# EAGLE design Open Playback Recorder Bottom (EAGLE 9.6.2)
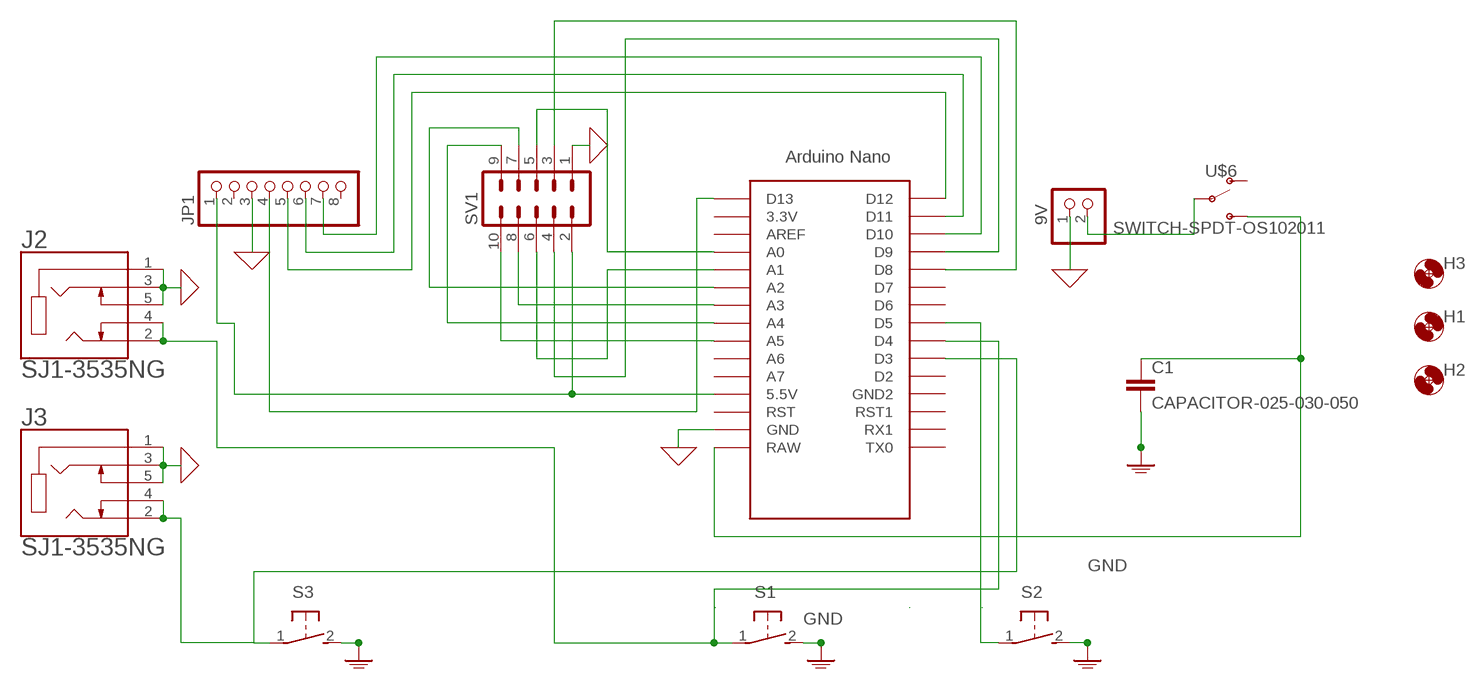
[diagram p0: schematic, sheet 1]

## Parts
9V  PINHD-1X2  [1X02]
C1  CAPACITOR-025-030-050  [CAP-025-030X050]
H1  MOUNT-HOLE-3MM-CLEAR  [HOLE-3MM-CLEAR]
H2  MOUNT-HOLE-3MM-CLEAR  [HOLE-3MM-CLEAR]
H3  MOUNT-HOLE-3MM-CLEAR  [HOLE-3MM-CLEAR]
J2  SJ1-3535NG  [CUI_SJ1-3535NG]
J3  SJ1-3535NG  [CUI_SJ1-3535NG]
JP1  HEADER_MALE-1X8ROUND  [1X08_ROUND]
S1  SWITCH_OMRON_RA-RA  [B3F-31XX]
S2  SWITCH_OMRON_RA-RA  [B3F-31XX]
S3  SWITCH_OMRON_RA-RA  [B3F-31XX]
SV1  MA05-2  [MA05-2]
U$1  NANO  [NANO]
U$6  SWITCH-SPDT-OS102011  [SWITCH_SPDT_11MA1QS1]

## Nets
GND: 9V.1 J2.1 J2.3 J2.5 J3.1 J3.3 J3.5 JP1.3 S1.2 S2.2 S3.2 SV1.1 U$1.GND
GND1: C1.2 ; supply symbol labelled GND
N$1: JP1.1 SV1.2 U$1.5V(5.5V)
N$6: 9V.2 U$6.2(P)
N$7: C1.1 U$1.RAW U$6.3(S)
N$15: J3.2 J3.4 S3.1 U$1.D3
N$19: J2.2 J2.4 S1.1 U$1.D4
N$20: S2.1 U$1.D5
N$22: SV1.10 U$1.A5
N$23: SV1.9 U$1.A4
N$24: SV1.8 U$1.A3
N$25: SV1.7 U$1.A2
N$26: SV1.6 U$1.A1
N$27: SV1.3 U$1.D8
N$28: SV1.4 U$1.D9
N$29: SV1.5 U$1.A0
N$30: JP1.7 U$1.D10
N$31: JP1.6 U$1.D11
N$32: JP1.5 U$1.D12
N$33: JP1.4 U$1.D13
Unconnected: JP1.2 JP1.8 U$1.3.3V U$1.A6 U$1.A7 U$1.AREF U$1.D2 U$1.D6 U$1.D7 U$1.GND1(GND2) U$1.ICSP1 U$1.ICSP2 U$1.ICSP3 U$1.ICSP4 U$1.ICSP5 U$1.ICSP6 U$1.RST U$1.RST1 U$1.RX1 U$1.TX0 U$6.1(O)

## Library data of the parts
9V = pinhead:PINHD-1X2: PIN HEADER
C1 = MMC_Eagle:CAPACITOR-
H1-H3 = MMC Eagle:MOUNT-HOLE-: MOUNTING HOLE with drill center marker
J2 J3 = SJ1-3535NG:SJ1-3535NG: SJ1 Series 3.5 mm 12 V Right Angle Through Hole Isolated Stereo Audio Jack; MANUFACTURER: CUI; PARTREV: 1.02; STANDARD: Manufacturer recommendation
JP1 = MMC_Eagle:HEADER_MALE-1X8: PIN HEADER
S1-S3 = MMC_Eagle:SWITCH_OMRON_RA: OMRON SWITCH Now with beefier pads!
SV1 = con-lstb:MA05-2: PIN HEADER; OC_FARNELL: unknown; OC_NEWARK: unknown
U$1 = Arduino-clone:NANO: Arduino Nano
U$6 = MMC_Eagle:SWITCH-SPDT-

## Board
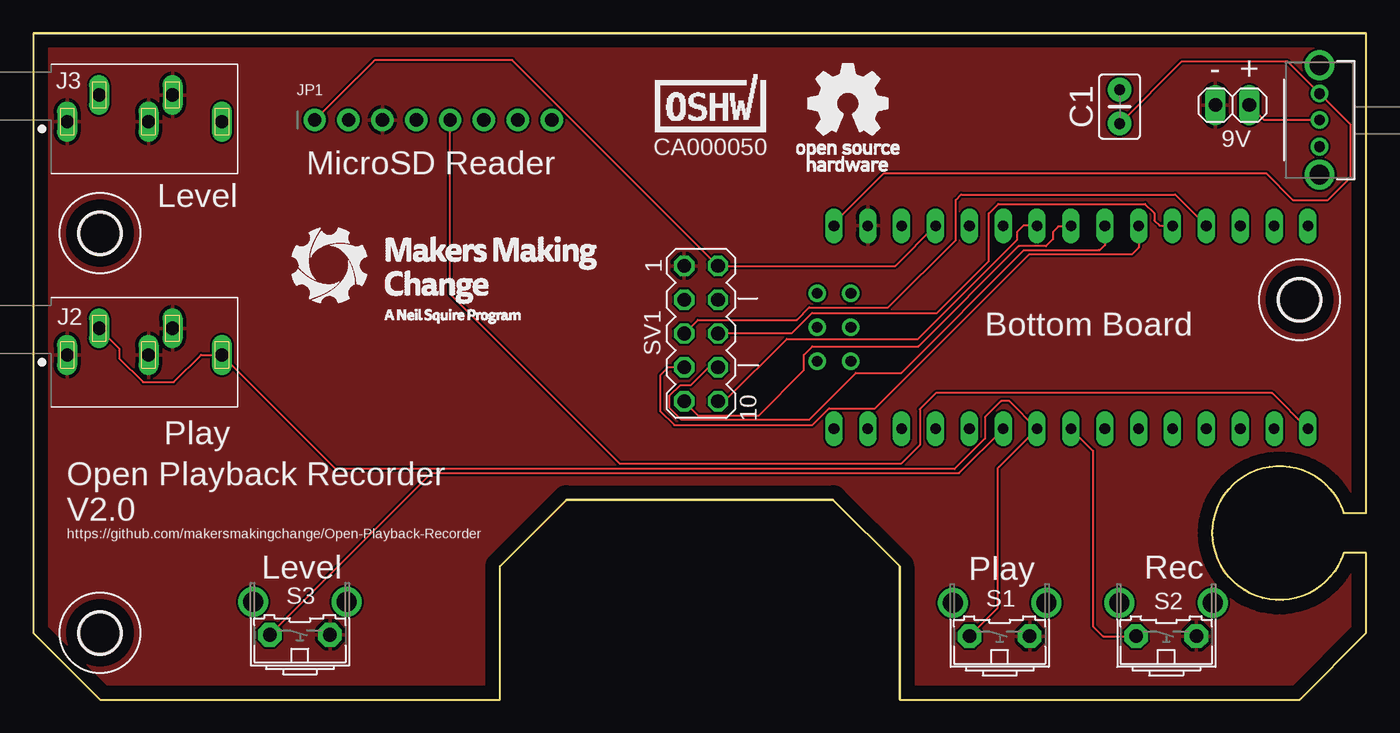
[diagram p1: board, top side]
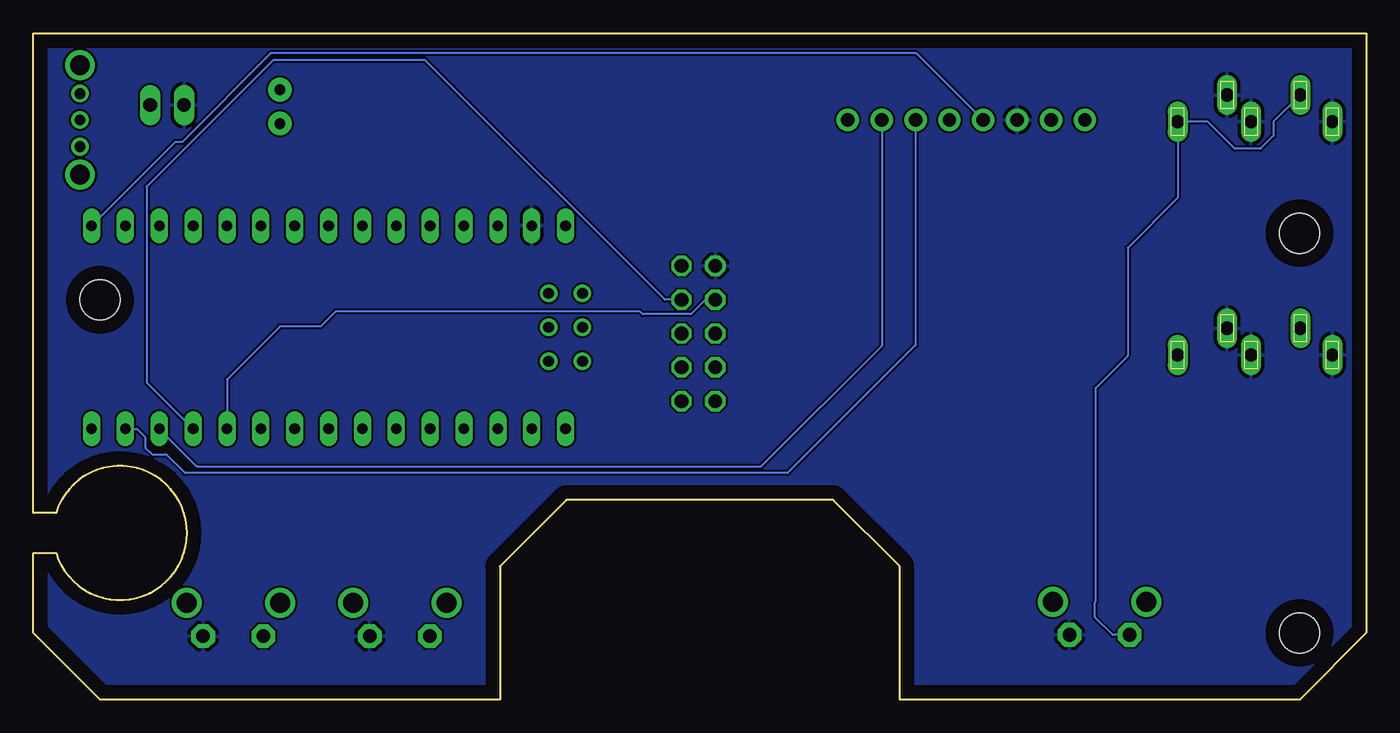
[diagram p2: board, bottom side, seen from below]

Size 100 x 50 mm. Coordinates in mm from the lower left corner, seen from the top.
Outline: 0,50 0,5 5,0 35,0 35,10 40,15 60,15 65,10 65,0 95,0 100,5 100,11 98.3,11 arc-325 98.3,14 100,14 100,50 0,50
Copper layers (1*16): Top 0.035mm / dielectric 1.5mm / Bottom 0.035mm
Design rules "default": minimum track width 6mil, minimum drill 0.35mm, track to track 6mil, track to pad 6mil, pad to pad 6mil, via to via 6mil, smd to smd 6mil, copper to edge 40mil, drill to drill 6mil, minimum pad ring 10mil, minimum via ring 8mil, stop-mask expansion 4mil, vias tented up to drill 0mil, thermal gap 10mil

### Footprints (pad centres in the part's own frame; a part is rotated, then mirrored left to right if it is on the bottom)
1X02 = drill 1.016 long: 1 -1.27,0; 2 1.27,0
CAP-025-030X050 = drill 0.813 pad 1.778: 1 -1.27,0; 2 1.27,0
HOLE-3MM-CLEAR = hole 3: 0,0
CUI_SJ1-3535NG = drill 1 long: 1 0,0; 2 2.4,2; 3 7.9,2; 4 11.6,0; 5 6.1,0
1X08_ROUND = drill 1 pad 1.676: 1 -8.89,0; 2 -6.35,0; 3 -3.81,0; 4 -1.27,0; 5 1.27,0; 6 3.81,0; 7 6.35,0; 8 8.89,0
B3F-31XX = drill 1.016 pad 1.778 octagon: 1 -2.261,-1.245; 2 2.261,-1.245 | drill 1.499 pad 2.032: 3 -3.505,1.245; 4 3.505,1.245
MA05-2 = drill 1.016 octagon: 1 -5.08,-1.27; 2 -5.08,1.27; 3 -2.54,-1.27; 4 -2.54,1.27; 5 0,-1.27; 6 0,1.27; 7 2.54,-1.27; 8 2.54,1.27; 9 5.08,-1.27; 10 5.08,1.27
NANO = drill 0.8 long: 3.3V -10.16,24.13; 5V -10.16,-1.27; A0 -10.16,19.05; A1 -10.16,16.51; A2 -10.16,13.97; A3 -10.16,11.43; A4 -10.16,8.89; A5 -10.16,6.35; A6 -10.16,3.81; A7 -10.16,1.27; AREF -10.16,21.59; D2 5.08,1.27; D3 5.08,3.81; D4 5.08,6.35; D5 5.08,8.89; D6 5.08,11.43; D7 5.08,13.97; D8 5.08,16.51; D9 5.08,19.05; D10 5.08,21.59; D11 5.08,24.13; D12 5.08,26.67; D13 -10.16,26.67; GND -10.16,-6.35; GND1 5.08,-1.27; RAW -10.16,-8.89; RST -10.16,-3.81; RST1 5.08,-3.81; RX1 5.08,-6.35; TX0 5.08,-8.89 | drill 0.8: ICSP1 -5.08,-10.16; ICSP2 -5.08,-7.62; ICSP3 -2.54,-10.16; ICSP4 -2.54,-7.62; ICSP5 0,-10.16; ICSP6 0,-7.62
SWITCH_SPDT_11MA1QS1 = drill 0.813 pad 1.321: 1 -2.007,0; 2 0,0; 3 1.981,0 | drill 1.499 pad 2.007: 4 -4.115,0; 5 4.089,0

### Placement (x,y rotation side)
9V  89.96,44.61 0 top
C1  81.5,44.5 90 top
H1  5,5 0 top
H2  5,35 0 top
H3  95,30 0 top
J2  2.54,25.86 0 top
J3  2.54,43.37 0 top
JP1  30,43.5 0 top
S1  72.5,6 0 top
S2  85,6 0 top
S3  20,6.1 0 top
SV1  50.1,27.47 270 top
U$1  68.96,25.4 270 top
U$2  CA000050  [OSHWA-CERT-SMALL-SILK]  50.8,42.6 0 top
U$3  [MMC_MEDIUM_LOGO]  30.8,31.8 0 top
U$4  [OSHW_SMALL_LOGO]  61.2,43.7 0 top
U$6  96.5,43.5 90 top

### Tracks (layer width: path | path; a pad name or v marks a point on that pad's centre or on a via)
GND
  pour Top: 0,50 100,50 100,5 95,0 65,0 65,10 60,15 40,15 35,10 35,0 5,0 0,5
  pour Bottom: 100,10.9 100,5 95,0 65,0 65,10 60,15 40,15 35,10 35,0 5,0 0,5 0,50 100,50
N$1
  Top 0.152: JP1.1 25.61,48 35.92,48 SV1.2 64.68,32.55 U$1.5V
N$6
  Top 0.152: U$6.2 92.34,43.5 9V.2
N$7
  Top 0.152: U$1.RAW 60.07,35.77 63.8,39.5 92.5,39.5 94.5,37.5 97.13,37.5 98.83,39.2 98.83,43.15 U$6.3 94.08,47.9 86.17,47.9 C1.1
N$15
  Top 0.152: S3.1 29.88,17 69.45,17 U$1.D3
  Bottom 0.152: J3.2 6.96,43.35 6.96,42.31 7.93,41.33 9.85,41.33 11.88,43.37 J3.4 14.14,37.66 17.9,33.9 17.9,25.8 20.3,23.4 20.3,7.35 20.35,7.3 20.35,6.18 19.02,4.86 S3.1
N$19
  Top 0.152: S1.1 72.36,6.87 72.36,17.37 U$1.D4 73.23,22.4 72.6,22.4 71.4,21.2 71.4,19.59 69.12,17.3 22.7,17.3 J2.4 12.58,25.86 10.55,23.82 8.23,23.82 6.46,25.6 6.46,26.34 J2.2
N$20
  Top 0.152: U$1.D5 79.5,18.67 79.5,5.5 80.25,4.75 S2.1
N$22
  Top 0.152: SV1.10 51.87,22.39 56.54,27.06 66.37,27.06 73.8,34.49 73.8,35.09 74.27,35.56 U$1.A5
N$23
  Top 0.152: SV1.9 49.92,21.3 54.4,21.3 57.82,24.72 57.82,25.87 58.45,26.5 66.4,26.5 73.92,34.02 75.98,34.02 76.5,34.55 76.5,35.1 76.9,35.5 77.79,35.5 U$1.A4
N$24
  Top 0.152: SV1.8 50.67,24.93 49.34,23.6 48.54,23.6 47.74,22.8 47.74,21.88 48.62,21 58.18,21 61.71,24.52 65.12,24.52 74.32,33.72 79.92,33.72 80.02,33.72 80.4,34.1 U$1.A3
N$25
  Top 0.152: SV1.7 47.63,24.93 47.03,24.34 47.03,21.65 48.09,20.6 58.45,20.6 59.7,21.86 63.16,21.86 74.7,33.4 82.4,33.4 82.93,33.93 U$1.A2
N$26
  Top 0.152: U$1.A1 84.5,35.56 84.1,35.96 84.1,36.5 83.4,37.2 72.4,37.2 71.69,36.48 71.69,32.91 67.8,29.02 58.43,29.02 56.88,27.47 SV1.6
N$27
  Bottom 0.152: U$1.D8 85.47,24.03 81.5,28 78.43,28 77.3,29.13 54.49,29.13 54.28,28.92 50.66,28.92 49.57,30.01 SV1.3
N$28
  Bottom 0.152: U$1.D9 91.5,23.81 91.5,38.5 82,48 70.61,48 52.62,30.01 SV1.4
N$29
  Top 0.152: U$1.A0 85.67,37.9 69.6,37.9 69.2,37.5 69.2,34.5 64.13,29.43 58.21,29.43 57.28,28.5 49.86,28.5 SV1.5
N$30
  Bottom 0.152: U$1.D10 87.73,17.5 45.4,17.5 36.35,26.55 JP1.7
N$31
  Bottom 0.152: JP1.6 33.81,26.59 43.41,17 88.61,17 90.02,18.4 91.1,18.4 91.6,18.9 91.6,19.7 92.22,20.32 U$1.D11
N$32
  Top 0.152: U$1.D12 92.95,23 67.7,23 66.5,21.8 66.5,19.1 65.1,17.7 44,17.7 31.27,30.43 JP1.5
N$33
  Bottom 0.152: U$1.D13 89.34,41.84 88.84,41.84 82.19,48.5 33.73,48.5 JP1.4

### Text on the board
tPlace: - + | C1 | MicroSD Reader | Bottom Board | Open Playback Recorder / V2.0 | https://github.com/makersmakingchange/Open-Playback-Recorder
tNames: Level | Play | Level | Play | Rec